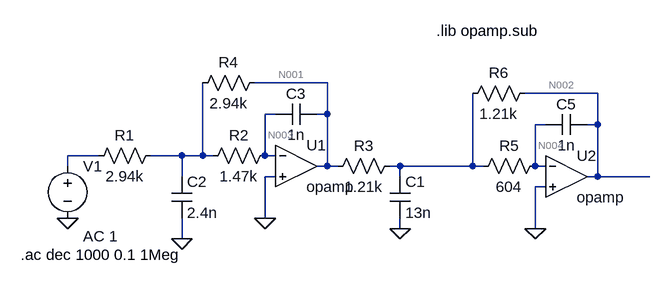
[diagram p0: schematic filtro nominal 1%.asc]
filtro nominal 1%.asc, the LTspice schematic file:
Version 4
SHEET 1 880 680
WIRE 144 112 32 112
WIRE 560 128 448 128
WIRE 64 160 48 160
WIRE 144 160 144 112
WIRE 144 160 128 160
WIRE 480 176 464 176
WIRE 560 176 560 128
WIRE 560 176 544 176
WIRE -208 224 -256 224
WIRE -80 224 -128 224
WIRE -48 224 -48 112
WIRE -48 224 -80 224
WIRE -32 224 -48 224
WIRE 48 224 48 160
WIRE 64 224 48 224
WIRE -256 240 -256 224
WIRE 144 240 144 160
WIRE 144 240 128 240
WIRE 160 240 144 240
WIRE 256 240 240 240
WIRE 368 240 368 128
WIRE 368 240 256 240
WIRE 384 240 368 240
WIRE 464 240 464 176
WIRE 480 240 464 240
WIRE -80 256 -80 224
WIRE 64 256 48 256
WIRE 256 256 256 240
WIRE 560 256 560 176
WIRE 560 256 544 256
WIRE 640 256 560 256
WIRE 480 272 464 272
WIRE 48 320 48 256
WIRE 256 336 256 320
WIRE 464 336 464 272
WIRE -80 352 -80 320
FLAG -256 320 0
FLAG 256 336 0
FLAG 48 320 0
FLAG -80 352 0
FLAG 464 336 0
SYMBOL Opamps\\opamp 96 176 R0
SYMATTR InstName U1
SYMBOL voltage -256 224 R0
WINDOW 123 24 124 Left 2
WINDOW 39 0 0 Left 2
SYMATTR InstName V1
SYMATTR Value ""
SYMATTR Value2 AC 1
SYMBOL res 256 224 R90
WINDOW 0 0 56 VBottom 2
WINDOW 3 32 56 VTop 2
SYMATTR InstName R3
SYMATTR Value 1.21k
SYMBOL cap 240 256 R0
SYMATTR InstName C1
SYMATTR Value 13n
SYMBOL res -224 240 R270
WINDOW 0 32 56 VTop 2
WINDOW 3 0 56 VBottom 2
SYMATTR InstName R1
SYMATTR Value 2.94k
SYMBOL cap -96 256 R0
SYMATTR InstName C2
SYMATTR Value 2.4n
SYMBOL res -48 240 R270
WINDOW 0 32 56 VTop 2
WINDOW 3 0 56 VBottom 2
SYMATTR InstName R2
SYMATTR Value 1.47k
SYMBOL res -64 128 R270
WINDOW 0 32 56 VTop 2
WINDOW 3 0 56 VBottom 2
SYMATTR InstName R4
SYMATTR Value 2.94k
SYMBOL cap 64 176 R270
WINDOW 0 32 32 VTop 2
WINDOW 3 0 32 VBottom 2
SYMATTR InstName C3
SYMATTR Value 1n
SYMBOL Opamps\\opamp 512 192 R0
SYMATTR InstName U2
SYMBOL res 368 256 R270
WINDOW 0 32 56 VTop 2
WINDOW 3 0 56 VBottom 2
SYMATTR InstName R5
SYMATTR Value 604
SYMBOL res 352 144 R270
WINDOW 0 32 56 VTop 2
WINDOW 3 0 56 VBottom 2
SYMATTR InstName R6
SYMATTR Value 1.21k
SYMBOL cap 480 192 R270
WINDOW 0 32 32 VTop 2
WINDOW 3 0 32 VBottom 2
SYMATTR InstName C5
SYMATTR Value 1n
TEXT 312 32 Left 2 !.lib opamp.sub
TEXT -328 376 Left 2 !.ac dec 1000 0.1 1Meg

The netlist it stands for:
* filtro nominal 1%.asc
XU1 N003 0 N001 opamp Aol=100K GBW=10Meg  ; pins invin noninvin out
V1 N005 0 AC 1
R3 N007 N001 1.21k
C1 N007 0 13n
R1 N005 N006 2.94k
C2 N006 0 2.4n
R2 N006 N003 1.47k
R4 N006 N001 2.94k
C3 N003 N001 1n
XU2 N004 0 N002 opamp Aol=100K GBW=10Meg  ; pins invin noninvin out
R5 N007 N004 604
R6 N007 N002 1.21k
C5 N004 N002 1n
.lib opamp.sub
.ac dec 1000 0.1 1Meg
.backanno
.end

* Results of the author's LTspice run, read from the files saved beside the schematic
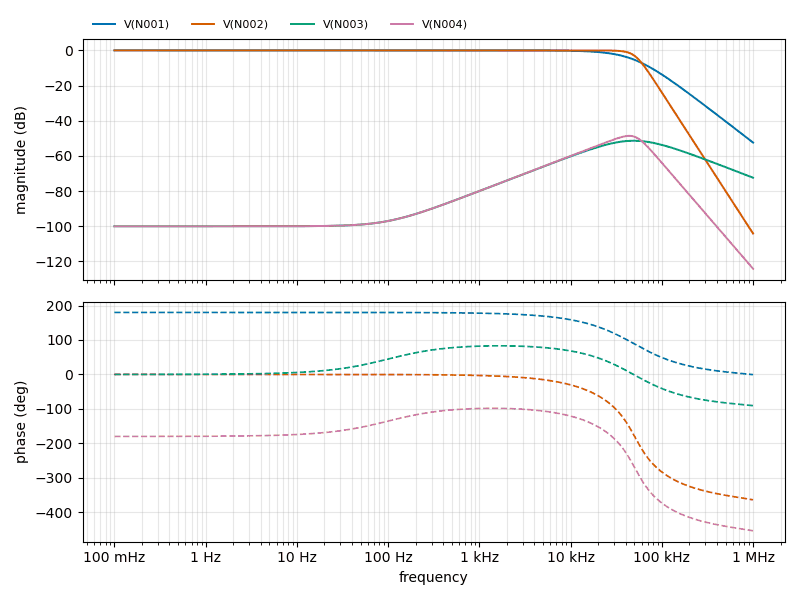
[diagram p1: AC Analysis of filtro nominal 1%.asc, plotted from the saved traces]
* AC Analysis, 1 run:
*   V(N001): -0.00 dB at 100 mHz, -52.40 dB at 1 MHz, peak -0.00 dB at 100 mHz, 3 dB below the peak at 36.09 kHz
*   V(N002): -0.00 dB at 100 mHz, -104.13 dB at 1 MHz, peak -0.00 dB at 100 mHz, 3 dB below the peak at 49.92 kHz
*   V(N003): -99.99 dB at 100 mHz, -72.40 dB at 1 MHz, peak -51.38 dB at 49.2 kHz, 3 dB below the peak at 21.72 kHz and 111.2 kHz
*   V(N004): -99.99 dB at 100 mHz, -124.13 dB at 1 MHz, peak -48.58 dB at 43.95 kHz, 3 dB below the peak at 26.62 kHz and 60.15 kHz